# Altium schematic sheet Meter.SchDoc
size A4
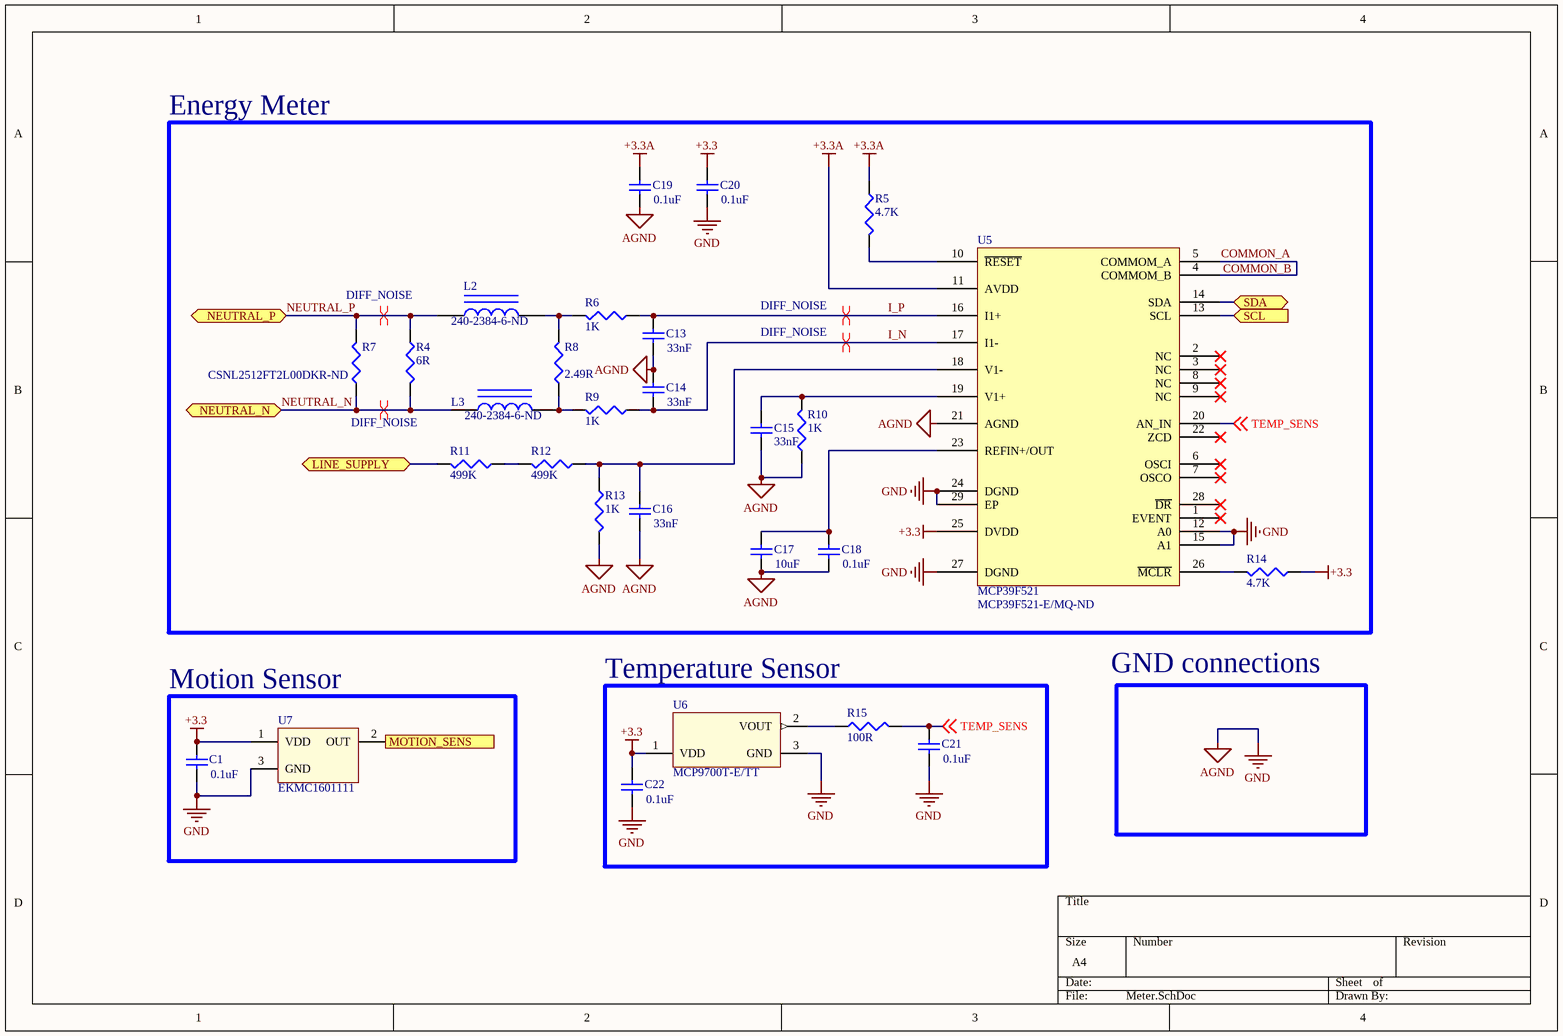
[diagram p0: Meter.SchDoc]

## Parts
C1  value 0.1uF  [C0603]  (hidden comment: MUDAR FOOTPRINT)
C13  value 33nF  [C0603]  (hidden comment: MUDAR FOOTPRINT)
C14  value 33nF  [C0603]  (hidden comment: MUDAR FOOTPRINT)
C15  value 33nF  [C0603]  (hidden comment: MUDAR FOOTPRINT)
C16  value 33nF  [C0603]  (hidden comment: MUDAR FOOTPRINT)
C17  value 10uF  [C0805]  (hidden comment: MUDAR FOOTPRINT)
C18  value 0.1uF  [C0603]  (hidden comment: MUDAR FOOTPRINT)
C19  value 0.1uF  [C0603]  (hidden comment: MUDAR FOOTPRINT)
C20  value 0.1uF  [C0603]  (hidden comment: MUDAR FOOTPRINT)
C21  value 0.1uF  [C0603]  (hidden comment: MUDAR FOOTPRINT)
C22  value 0.1uF  [C0603]  (hidden comment: MUDAR FOOTPRINT)
L2  Supplier Part Number 1: 240-2384-6-ND  [6-0805_N]  (hidden comment: FERRITE BEAD)
L3  Supplier Part Number 1: 240-2384-6-ND  [6-0805_N]  (hidden comment: FERRITE BEAD)
R4  value 6R  [R0603]  (hidden comment: Res3)
R5  value 4.7K  [R0603]  (hidden comment: Res3)
R6  value 1K  [R0603]  (hidden comment: Res3)
R7  Supplier Part Number 1: CSNL2512FT2L00DKR-ND  [RES2512]  (hidden comment: SHUNT)
R8  value 2.49R  [R0603]  (hidden comment: Res3)
R9  value 1K  [R0603]  (hidden comment: Res3)
R10  value 1K  [R0603]  (hidden comment: Res3)
R11  value 499K  [12Z-2010]  (hidden comment: Res3)
R12  value 499K  [12Z-2010]  (hidden comment: Res3)
R13  value 1K  [R0603]  (hidden comment: Res3)
R14  value 4.7K  [R0603]  (hidden comment: Res3)
R15  value 100R  [R0603]  (hidden comment: Res3)
U5  MCP39F521  Supplier Part Number 1: MCP39F521-E/MQ-ND  [MCP39F521]
U6  MCP9700T-E/TT  [SOT-233]
U7  EKMC1601111  [EKMC1601111]

## Blocks framed on the sheet
Energy Meter: C13-C20 L2 L3 R4-R14 U5
Motion Sensor: C1 U7
Temperature Sensor: C21 C22 R15 U6

## Ports
LINE_SUPPLY (bidir), MOTION_SENS (out), NEUTRAL_N (bidir), NEUTRAL_P (bidir), SCL (in), SDA (bidir)

## Nets
+3.3: C1.2 C20.2 C22.2 R14.2 U5.25(DVDD) U6.1(VDD) U7.1(VDD)
+3.3A: C19.2 R5.1 U5.11(AVDD)
AGND: C1.1 C13.1 C14.2 C15.1 C16.1 C17.1 C18.1 C19.1 C20.1 C21.1 C22.1 R10.2 R13.2 U5.12(A0) U5.15(A1) U5.21(AGND) U5.24(DGND) U5.27(DGND) U5.29(EP) U6.3(GND) U7.3(GND)  [also labelled GND]
COMMON_A: U5.4(COMMOM_B) U5.5(COMMOM_A)
I_N: C14.1 R9.1 U5.17(I1-)
I_P: C13.2 R6.1 U5.16(I1+)
LINE_SUPPLY: R11.2 ; port LINE_SUPPLY
MOTION_SENS: U7.2(OUT) ; port MOTION_SENS
NEUTRAL_N: L3.1 R4.2 R7.1 ; port NEUTRAL_N
NEUTRAL_P: L2.1 R4.1 R7.2 ; port NEUTRAL_P
SCL: U5.13(SCL) ; port SCL
SDA: U5.14(SDA) ; port SDA
TEMP_SENS: C21.2 R15.2 U5.20(AN_IN) ; off-sheet TEMP_SENS
NetC15_2: C15.2 R10.1 U5.19(V1+)
NetC16_2: C16.2 R12.1 R13.1 U5.18(V1-)
NetC17_2: C17.2 C18.2 U5.23(REFIN+/OUT)
NetL2_2: L2.2 R6.2 R8.2
NetL3_2: L3.2 R8.1 R9.2
NetR5_2: R5.2 U5.10(~{RESET})
NetR11_1: R11.1 R12.2
NetR14_1: R14.1 U5.26(~{MCLR})
NetR15_1: R15.1 U6.2(VOUT)

Not connected (* = marked no-connect by the designer): U5 1(EVENT)* 2(NC)* 3(NC)* 6(OSCI)* 7(OSCO)* 8(NC)* 9(NC)* 22(ZCD)* 28(~{DR})*

## Layout directives
differential pair; net class DIFF_NOISE: I_N, I_P, NEUTRAL_N, NEUTRAL_P

## Notes on the sheet
- GND connections
- Labels drawn without touching a wire or pin: COMMON_B

## Library data of the parts
C1 C13-C22 = Cap Semi: Capacitor (Semiconductor SIM Model); Published: 8-Jun-2000; LatestRevisionDate: 29-May-2009; LatestRevisionNote: IPC-7351 Footprint Added.; PackageReference: C1206; Publisher: Altium Limited; PackageDescription: Chip Capacitor
L2 L3 = Inductor Iron: Magnetic-Core Inductor; Value: 10mH; Published: 24-Mar-1999; LatestRevisionDate: 17-Jul-2002; LatestRevisionNote: Re-released for DXP Platform.; PackageReference: AXIAL-0.9; Publisher: Altium Limited; PackageDescription: Axial Device, Thru-Hole; 2 Leads; 0.9 in Pin Spacing; Supplier 1: Digi-Key
R4-R6 R8-R15 = Res3: Resistor; Published: 8-Jun-2000; LatestRevisionDate: 29-May-2009; LatestRevisionNote: IPC-7351 Footprint Added.; PackageReference: J1-0603; Publisher: Altium Limited; PackageDescription: Chip Resistor
R7 = Res3: Resistor; Value: CSNL2512FT2L00DKR-ND; Published: 8-Jun-2000; LatestRevisionDate: 29-May-2009; LatestRevisionNote: IPC-7351 Footprint Added.; PackageReference: J1-0603; Publisher: Altium Limited; PackageDescription: Chip Resistor; Supplier 1: Digi-Key
U6 = MCP9700T-E/TT: MCP9700 Series 5 V -40 to +125Â°C Low-Power Linear Active Thermistor; MF: Microchip; SnapEDA_Link: https://www.snapeda.com/parts/MCP9700T-E/TT/Microchip/view-part/?ref=snap; Price: None; Package: SOT-23-3 Microchip; MP: MCP9700T-E/TT; Availability: Unavailable; Value: *
U7 = EKMC1601111: Board Mount Motion & Position Sensors Digital 170uA 5m White; Manufacturer_Name: Panasonic; Manufacturer_Part_Number: EKMC1601111; RS Part Number: 1357095; RS Price/Stock: http://uk.rs-online.com/web/p/products/1357095; Arrow Part Number: EKMC1601111; Arrow Price/Stock: https://www.arrow.com/en/products/ekmc1601111/panasonic; Datasheet Link: http://www3.panasonic.biz/ac/e/search_num/index.jsp?c=detail&part_no=EKMC1601111
U5 = MCP39F521: Supplier 1: Digi-Key